# EAGLE design mainboard (EAGLE 9.4.2)

## Sheet 1 of 2
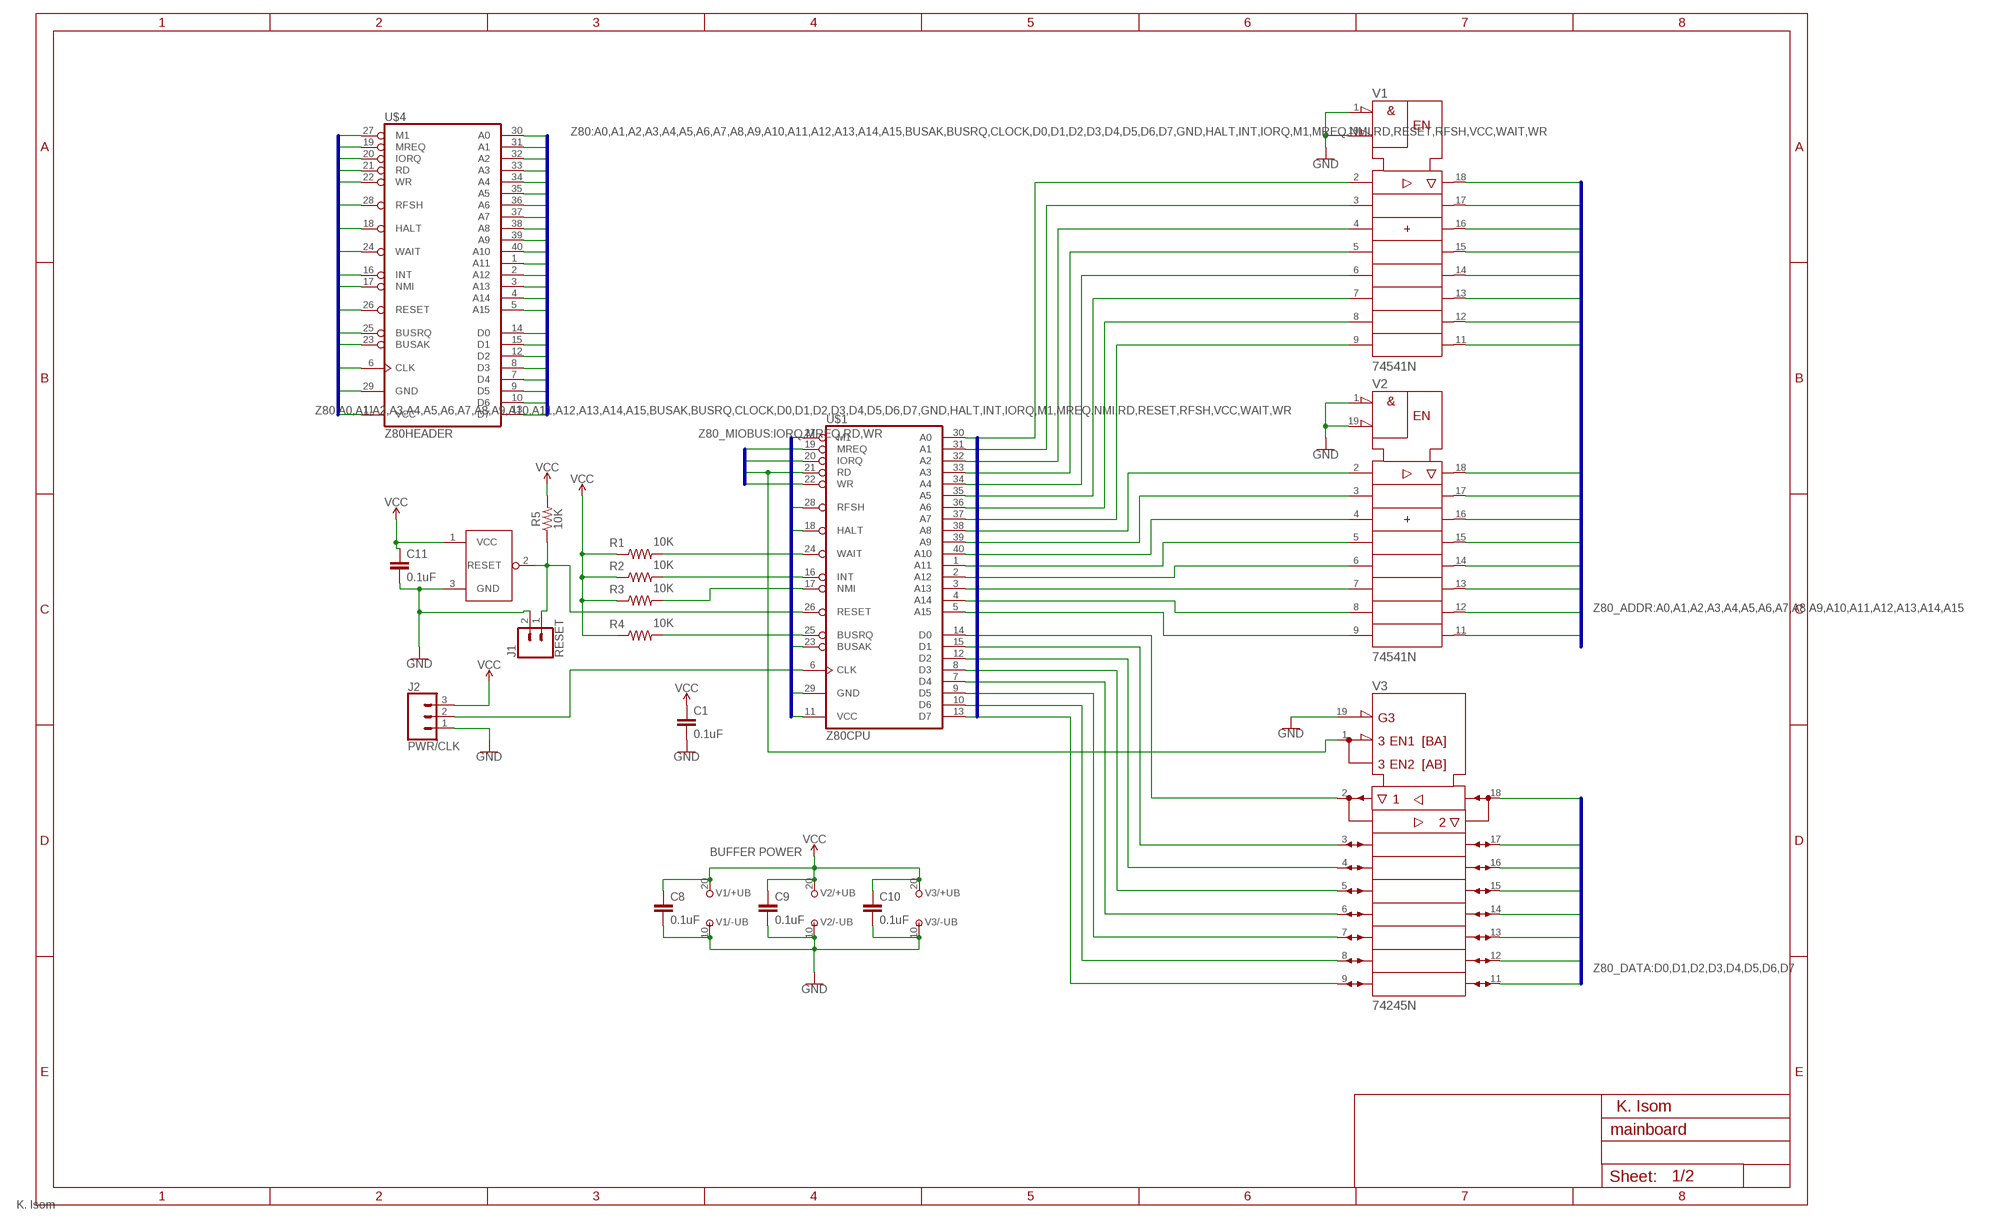
[diagram p0: schematic, sheet 1]
FRAME2 (A3L-LOC): DESIGNER: K. Isom

### Parts
C1  0.1uF  C2,5-3  [C2.5-3]
C8  0.1uF  C2,5-3  [C2.5-3]
C9  0.1uF  C2,5-3  [C2.5-3]
C10  0.1uF  C2,5-3  [C2.5-3]
C11  0.1uF  C2,5-3  [C2.5-3]
J1  RESET  CONN_02  [1X02]
J2  PWR/CLK  CONN_03-SCREW-5MM  [SCREWTERMINAL-5MM-3]
R1  10K  RESISTORAXIAL-0.3  [AXIAL-0.3]
R2  10K  RESISTORAXIAL-0.3  [AXIAL-0.3]
R3  10K  RESISTORAXIAL-0.3  [AXIAL-0.3]
R4  10K  RESISTORAXIAL-0.3  [AXIAL-0.3]
R5  10K  RESISTORAXIAL-0.3  [AXIAL-0.3]
U$1  Z80CPU  [DIL40]
U$2  MCP120/MCP130  [TO-92-AMMO]
U$4  Z80HEADER  [2X20]
V1  74541N  [DIL20]
V2  74541N  [DIL20]
V3  74245N  [DIL20]

### Nets
A0: U$1.30(A0) U$4.30(A0) V1.2(A1) V1.18(Y1) ; also sheet 2
A1: U$1.31(A1) U$4.31(A1) V1.3(A2) V1.17(Y2) ; also sheet 2
A2: U$1.32(A2) U$4.32(A2) V1.4(A3) V1.16(Y3) ; also sheet 2
A3: U$1.33(A3) U$4.33(A3) V1.5(A4) V1.15(Y4) ; also sheet 2
A4: U$1.34(A4) U$4.34(A4) V1.6(A5) V1.14(Y5) ; also sheet 2
A5: U$1.35(A5) U$4.35(A5) V1.7(A6) V1.13(Y6) ; also sheet 2
A6: U$1.36(A6) U$4.36(A6) V1.8(A7) V1.12(Y7) ; also sheet 2
A7: U$1.37(A7) U$4.37(A7) V1.9(A8) V1.11(Y8) ; also sheet 2
A8: U$1.38(A8) U$4.38(A8) V2.2(A1) V2.18(Y1) ; also sheet 2
A9: U$1.39(A9) U$4.39(A9) V2.3(A2) V2.17(Y2) ; also sheet 2
A10: U$1.40(A10) U$4.40(A10) V2.4(A3) V2.16(Y3) ; also sheet 2
A11: U$1.1(A11) U$4.1(A11) V2.5(A4) V2.15(Y4) ; also sheet 2
A12: U$1.2(A12) U$4.2(A12) V2.6(A5) V2.14(Y5) ; also sheet 2
A13: U$1.3(A13) U$4.3(A13) V2.7(A6) V2.13(Y6) ; also sheet 2
A14: U$1.4(A14) U$4.4(A14) V2.8(A7) V2.12(Y7) ; also sheet 2
A15: U$1.5(A15) U$4.5(A15) V2.9(A8) V2.11(Y8) ; also sheet 2
BUSAK: U$1.23(BUSAK) U$4.23(BUSAK)
BUSRQ: R4.P$2 U$1.25(BUSRQ) U$4.25(BUSRQ)
CLOCK: J2.2 U$1.6(CLK) U$4.6(CLK)
D0: U$1.14(D0) U$4.14(D0) V3.2(A1) V3.18(B1) ; also sheet 2
D1: U$1.15(D1) U$4.15(D1) V3.3(A2) V3.17(B2) ; also sheet 2
D2: U$1.12(D2) U$4.12(D2) V3.4(A3) V3.16(B3) ; also sheet 2
D3: U$1.8(D3) U$4.8(D3) V3.5(A4) V3.15(B4) ; also sheet 2
D4: U$1.7(D4) U$4.7(D4) V3.6(A5) V3.14(B5) ; also sheet 2
D5: U$1.9(D5) U$4.9(D5) V3.7(A6) V3.13(B6) ; also sheet 2
D6: U$1.10(D6) U$4.10(D6) V3.8(A7) V3.12(B7) ; also sheet 2
D7: U$1.13(D7) U$4.13(D7) V3.9(A8) V3.11(B8) ; also sheet 2
GND: C1.2 C8.2 C9.2 C10.2 C11.2 J1.2 J2.1 U$1.29(GND) U$2.3(GND) U$4.29(GND) V1.1(!G1) V1.10(-UB) V1.19(!G2) V2.1(!G1) V2.10(-UB) V2.19(!G2) V3.10(-UB) V3.19(!G) ; also sheet 2
HALT: U$1.18(HALT) U$4.18(HALT)
INT: R2.P$2 U$1.16(INT) U$4.16(INT)
IORQ: U$1.20(IORQ) U$4.20(IORQ)
M1: U$1.27(M1) U$4.27(M1)
MREQ: U$1.19(MREQ) U$4.19(MREQ) ; also sheet 2
NMI: R3.P$2 U$1.17(NMI) U$4.17(NMI)
RD: U$1.21(RD) U$4.21(RD) V3.1(DIR) ; also sheet 2
RESET: J1.1 R5.P$1 U$1.26(RESET) U$2.2(RESET) U$4.26(RESET)
RFSH: U$1.28(RFSH) U$4.28(RFSH)
VCC: C1.1 C8.1 C9.1 C10.1 C11.1 J2.3 R1.P$1 R2.P$1 R3.P$1 R4.P$1 R5.P$2 U$1.11(VCC) U$2.1(VCC) U$4.11(VCC) V1.20(+UB) V2.20(+UB) V3.20(+UB) ; also sheet 2
WAIT: R1.P$2 U$1.24(WAIT) U$4.24(WAIT)
WR: U$1.22(WR) U$4.22(WR) ; also sheet 2

### Buses
Z80:A0,A1,A2,A3,A4,A5,A6,A7,A8,A9,A10,A11,A12,A13,A14,A15,BUSAK,BUSRQ,CLOCK,D0,D1,D2,D3,D4,D5,D6,D7,GND,HALT,INT,IORQ,M1,MREQ,NMI,RD,RESET,RFSH,VCC,WAIT,WR
Z80_MIOBUS:IORQ,MREQ,RD,WR
Z80_ADDR:A0,A1,A2,A3,A4,A5,A6,A7,A8,A9,A10,A11,A12,A13,A14,A15
Z80_DATA:D0,D1,D2,D3,D4,D5,D6,D7

### Notes on the sheet
- BUFFER POWER
- K. Isom

## Sheet 2 of 2
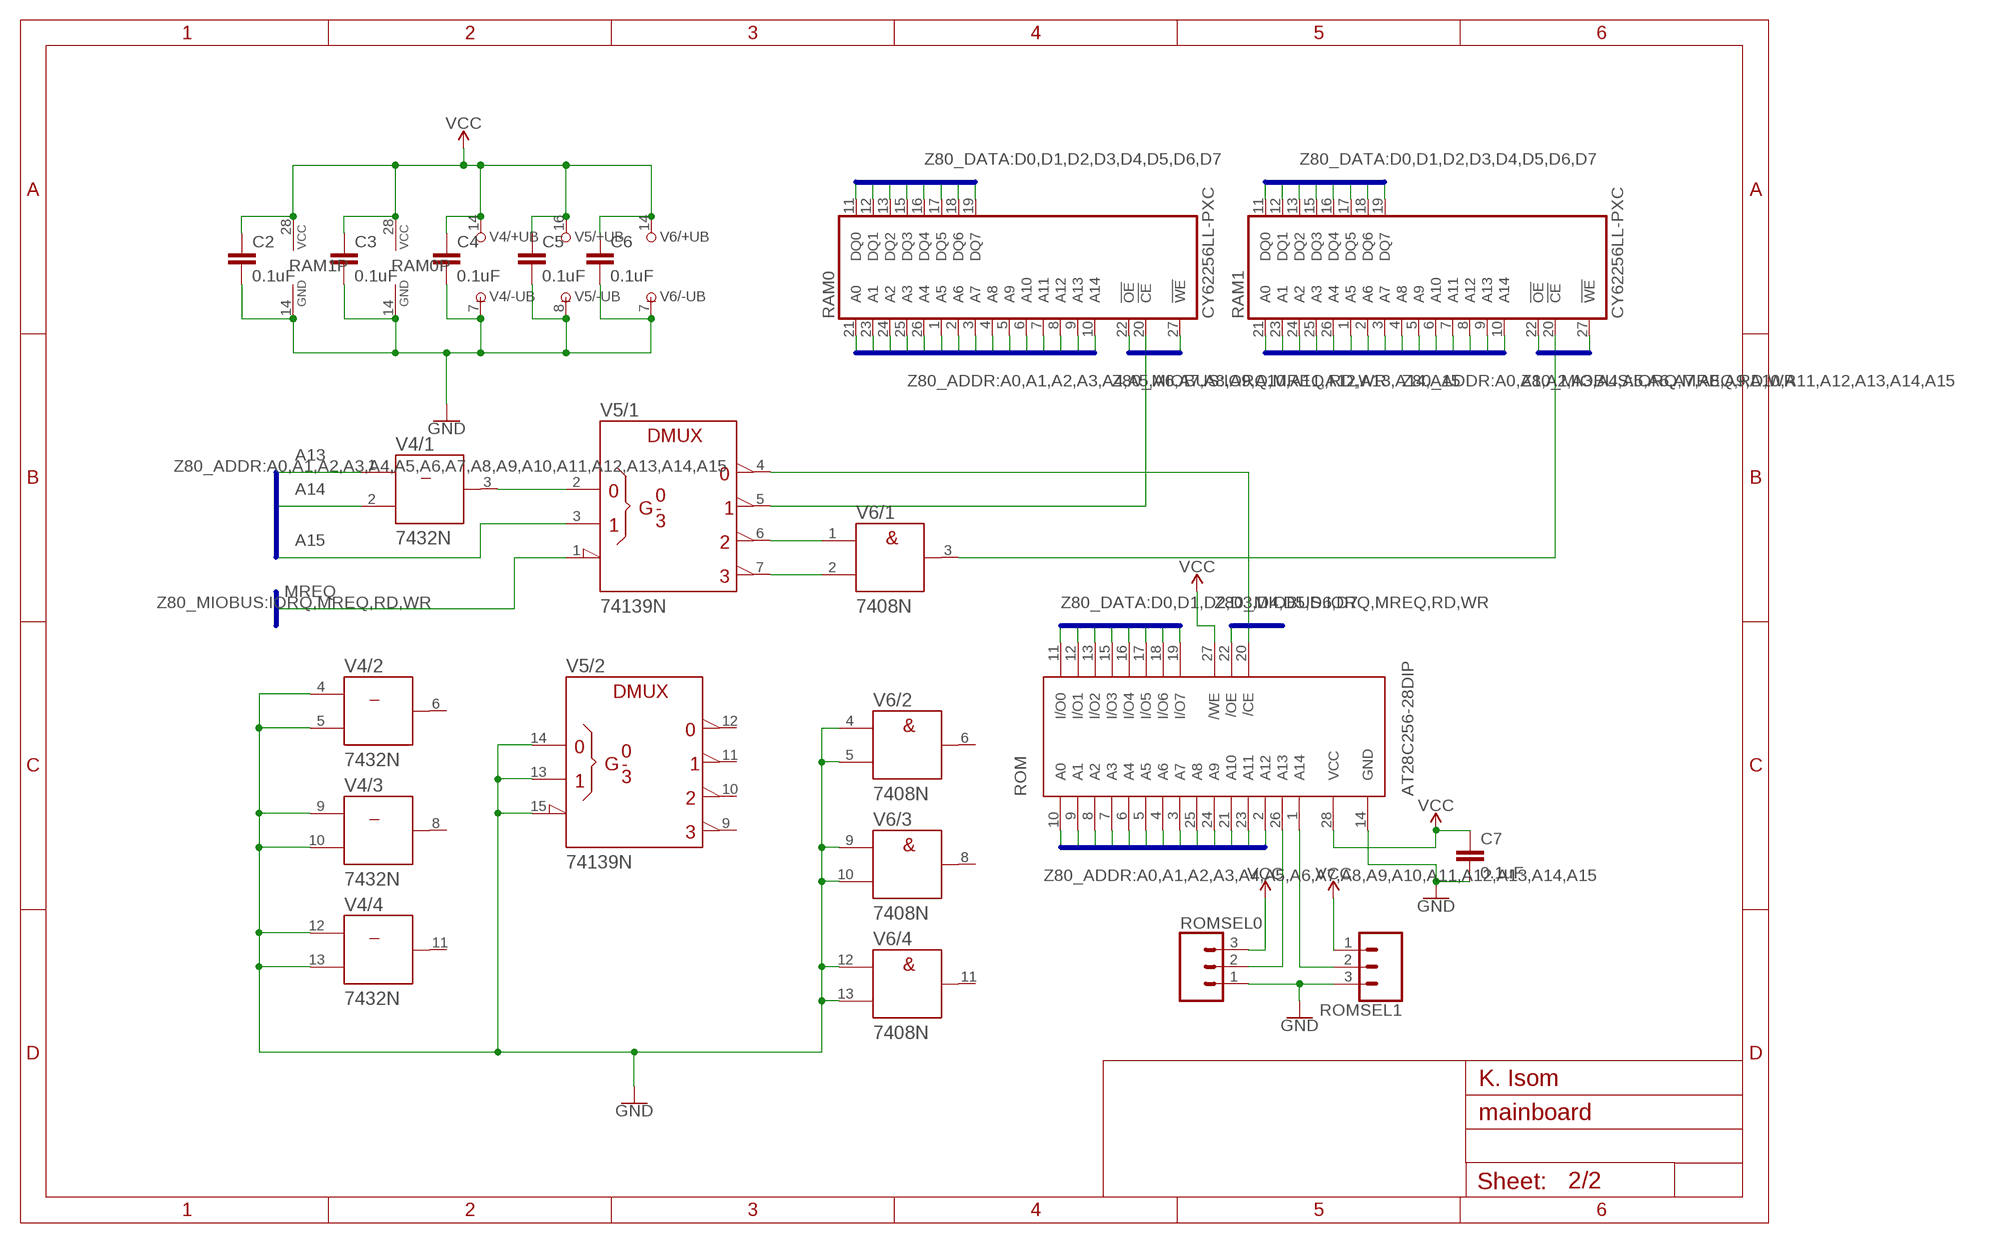
[diagram p1: schematic, sheet 2]

### Parts
C2  0.1uF  C2,5-3  [C2.5-3]
C3  0.1uF  C2,5-3  [C2.5-3]
C4  0.1uF  C2,5-3  [C2.5-3]
C5  0.1uF  C2,5-3  [C2.5-3]
C6  0.1uF  C2,5-3  [C2.5-3]
C7  0.1uF  C2,5-3  [C2.5-3]
RAM0  CY62256LL-PXC  [DIL28-6]
RAM1  CY62256LL-PXC  [DIL28-6]
ROM  AT28C256-28DIP  [DIL28-6]
ROMSEL0  455-1750-1-ND  CONN_03  [1X03]
ROMSEL1  455-1750-1-ND  CONN_03  [1X03]
V4  7432N  [DIL14]
V5  74139N  [DIL16]
V6  7408N  [DIL14]

### Nets
A0: RAM0.21(A0) RAM1.21(A0) ROM.10(A0) ; also sheet 1
A1: RAM0.23(A1) RAM1.23(A1) ROM.9(A1) ; also sheet 1
A2: RAM0.24(A2) RAM1.24(A2) ROM.8(A2) ; also sheet 1
A3: RAM0.25(A3) RAM1.25(A3) ROM.7(A3) ; also sheet 1
A4: RAM0.26(A4) RAM1.26(A4) ROM.6(A4) ; also sheet 1
A5: RAM0.1(A5) RAM1.1(A5) ROM.5(A5) ; also sheet 1
A6: RAM0.2(A6) RAM1.2(A6) ROM.4(A6) ; also sheet 1
A7: RAM0.3(A7) RAM1.3(A7) ROM.3(A7) ; also sheet 1
A8: RAM0.4(A8) RAM1.4(A8) ROM.25(A8) ; also sheet 1
A9: RAM0.5(A9) RAM1.5(A9) ROM.24(A9) ; also sheet 1
A10: RAM0.6(A10) RAM1.6(A10) ROM.21(A10) ; also sheet 1
A11: RAM0.7(A11) RAM1.7(A11) ROM.23(A11) ; also sheet 1
A12: RAM0.8(A12) RAM1.8(A12) ROM.2(A12) ; also sheet 1
A13: RAM0.9(A13) RAM1.9(A13) V4.1(/1:A) ; also sheet 1
A14: RAM0.10(A14) RAM1.10(A14) V4.2(/1:B) ; also sheet 1
A15: V5.3(/1:B) ; also sheet 1
D0: RAM0.11(DQ0) RAM1.11(DQ0) ROM.11(I/O0) ; also sheet 1
D1: RAM0.12(DQ1) RAM1.12(DQ1) ROM.12(I/O1) ; also sheet 1
D2: RAM0.13(DQ2) RAM1.13(DQ2) ROM.13(I/O2) ; also sheet 1
D3: RAM0.15(DQ3) RAM1.15(DQ3) ROM.15(I/O3) ; also sheet 1
D4: RAM0.16(DQ4) RAM1.16(DQ4) ROM.16(I/O4) ; also sheet 1
D5: RAM0.17(DQ5) RAM1.17(DQ5) ROM.17(I/O5) ; also sheet 1
D6: RAM0.18(DQ6) RAM1.18(DQ6) ROM.18(I/O6) ; also sheet 1
D7: RAM0.19(DQ7) RAM1.19(DQ7) ROM.19(I/O7) ; also sheet 1
GND: C2.2 C3.2 C4.2 C5.2 C6.2 C7.2 RAM0.14(GND) RAM1.14(GND) ROM.14(GND) ROMSEL0.1 ROMSEL1.3 V4.4(/2:A) V4.5(/2:B) V4.7(/-UB:-UB) V4.9(/3:A) V4.10(/3:B) V4.12(/4:A) V4.13(/4:B) V5.8(/-UB:-UB) V5.13(/2:B) V5.14(/2:A) V5.15(/2:!G) V6.4(/2:A) V6.5(/2:B) V6.7(/-UB:-UB) V6.9(/3:A) V6.10(/3:B) V6.12(/4:A) V6.13(/4:B) ; also sheet 1
MREQ: V5.1(/1:!G) ; also sheet 1
N$1: ROM.26(A13) ROMSEL0.2
N$2: V4.3(/1:Y) V5.2(/1:A)
N$3: V5.6(/1:Y2) V6.1(/1:A)
N$4: V5.7(/1:Y3) V6.2(/1:B)
N$5: RAM0.20(!CE) V5.5(/1:Y1)
N$6: ROM.20(/CE) V5.4(/1:Y0)
N$7: RAM1.20(!CE) V6.3(/1:Y)
N$9: ROM.1(A14) ROMSEL1.2
RD: RAM0.22(!OE) RAM1.22(!OE) ROM.22(/OE) ; also sheet 1
VCC: C2.1 C3.1 C4.1 C5.1 C6.1 C7.1 RAM0.28(VCC) RAM1.28(VCC) ROM.27(/WE) ROM.28(VCC) ROMSEL0.3 ROMSEL1.1 V4.14(/+UB:+UB) V5.16(/+UB:+UB) V6.14(/+UB:+UB) ; also sheet 1
WR: RAM0.27(!WE) RAM1.27(!WE) ; also sheet 1
Unconnected: V4.6(/2:Y) V4.8(/3:Y) V4.11(/4:Y) V5.9(/2:Y3) V5.10(/2:Y2) V5.11(/2:Y1) V5.12(/2:Y0) V6.6(/2:Y) V6.8(/3:Y) V6.11(/4:Y)

### Buses
Z80_ADDR:A0,A1,A2,A3,A4,A5,A6,A7,A8,A9,A10,A11,A12,A13,A14,A15
Z80_MIOBUS:IORQ,MREQ,RD,WR
Z80_DATA:D0,D1,D2,D3,D4,D5,D6,D7

### Notes on the sheet
- A13
- A14
- A15
- MREQ
- K. Isom

## Library data of the parts
C1-C11 = capacitor-wima:C: CAPACITOR naming: grid - package width
J1 = SparkFun-Connectors:CONN_02: Multi connection point. Often used as Generic Header-pin footprint for 0.1 inch spaced/style header connections On any of the 0.1 inch spaced packages, you can populate with these: Break Away Headers - Straight <https://www.sparkfun.com/products/116> (PRT-00116) Break Away Male Headers - Right Angle <https://www.sparkfun.com/products/553> (PRT-00553) Female Headers <https://www.sparkfun.com/products/115> (PRT-00115) Break Away Headers - Machine Pin <https://www.sparkfun.com/products/117> (PRT-00117) Break Away Female Headers - Swiss Machine Pin <https://www.sparkfun.com/products/743> (PRT-00743) For SCREWTERMINALS and SPRING TERMINALS visit here: Screw Terimnals on SparkFun.com <https://www.sparkfun.com/search/results?term=Screw+Terminals> (5mm/3.5mm/2.54mm spacing) This device is also useful as a general connection point to wire up your design to another part of your project. Our various solder wires solder well into these plated through hole pads. Hook-Up Wire - Assortment (Stranded, 22 AWG) <https://www.sparkfun.com/products/11375> (PRT-11375) Hook-Up Wire - Assortment (Solid Core, 22 AWG) <https://www.sparkfun.com/products/11367> (PRT-11367) View the entire wire category on our website here <https://www.sparkfun.com/categories/141> Special notes: Molex polarized connector foot print use with: PRT-08233 with associated crimp pins and housings. 2.54_SCREWTERM for use with PRT-10571. 3.5mm Screw Terminal footprints for PRT-08084 5mm Screw Terminal footprints for use with PRT-08432
J2 = SparkFun-Connectors:CONN_03: Multi connection point. Often used as Generic Header-pin footprint for 0.1 inch spaced/style header connections On any of the 0.1 inch spaced packages, you can populate with these: Break Away Headers - Straight <https://www.sparkfun.com/products/116> (PRT-00116) Break Away Male Headers - Right Angle <https://www.sparkfun.com/products/553> (PRT-00553) Female Headers <https://www.sparkfun.com/products/115> (PRT-00115) Break Away Headers - Machine Pin <https://www.sparkfun.com/products/117> (PRT-00117) Break Away Female Headers - Swiss Machine Pin <https://www.sparkfun.com/products/743> (PRT-00743) Stackable Header - 3 Pin (Female, 0.1") <https://www.sparkfun.com/products/13875> (PRT-13875) For SCREWTERMINALS and SPRING TERMINALS visit here: Screw Terimnals on SparkFun.com <https://www.sparkfun.com/search/results?term=Screw+Terminals> (5mm/3.5mm/2.54mm spacing) This device is also useful as a general connection point to wire up your design to another part of your project. Our various solder wires solder well into these plated through hole pads. Hook-Up Wire - Assortment (Stranded, 22 AWG) <https://www.sparkfun.com/products/11375> (PRT-11375) Hook-Up Wire - Assortment (Solid Core, 22 AWG) <https://www.sparkfun.com/products/11367> (PRT-11367) View the entire wire category on our website here <https://www.sparkfun.com/categories/141> Special notes: Molex polarized connector foot print use with SKU : PRT-08232 with associated crimp pins and housings.; PROD_ID: CONN-10134; SF_SKU: PRT-08433
R1-R5 = SparkFun-Resistors:RESISTOR: Generic Resistor Package
RAM0 RAM1 = memory-sram:CY62256LL-?*: 256K (32K x 8) CMOS-Static RAM Source: http://download.cypress.com.edgesuite.net/design_resources/datasheets/contents/cy62256_8.pdf
ROM = atmel-custom:AT28C256-28DIP: IC EEPROM 256KBIT 150NS 28DIP
ROMSEL0 ROMSEL1 = SparkFun-Connectors:CONN_03: Multi connection point. Often used as Generic Header-pin footprint for 0.1 inch spaced/style header connections On any of the 0.1 inch spaced packages, you can populate with these: Break Away Headers - Straight <https://www.sparkfun.com/products/116> (PRT-00116) Break Away Male Headers - Right Angle <https://www.sparkfun.com/products/553> (PRT-00553) Female Headers <https://www.sparkfun.com/products/115> (PRT-00115) Break Away Headers - Machine Pin <https://www.sparkfun.com/products/117> (PRT-00117) Break Away Female Headers - Swiss Machine Pin <https://www.sparkfun.com/products/743> (PRT-00743) Stackable Header - 3 Pin (Female, 0.1") <https://www.sparkfun.com/products/13875> (PRT-13875) For SCREWTERMINALS and SPRING TERMINALS visit here: Screw Terimnals on SparkFun.com <https://www.sparkfun.com/search/results?term=Screw+Terminals> (5mm/3.5mm/2.54mm spacing) This device is also useful as a general connection point to wire up your design to another part of your project. Our various solder wires solder well into these plated through hole pads. Hook-Up Wire - Assortment (Stranded, 22 AWG) <https://www.sparkfun.com/products/11375> (PRT-11375) Hook-Up Wire - Assortment (Solid Core, 22 AWG) <https://www.sparkfun.com/products/11367> (PRT-11367) View the entire wire category on our website here <https://www.sparkfun.com/categories/141> Special notes: Molex polarized connector foot print use with SKU : PRT-08232 with associated crimp pins and housings.; PROD_ID: XXX-00000
U$1 U$4 = wntrmute:Z80
U$2 = wntrmute:MCP120/MCP130: Microcontroller Supervisory Circuit with Open Drain Output. Digikey part MCP120-485HI/TO-ND <https://www.digikey.com/product-detail/en/MCP120-485HI%2fTO/MCP120-485HI%2fTO-ND/319366/?itemSeq=301799207>.
V1 V2 = 74ttl-din:74*541: Octal BUFFER and LINE DRIVER, 3-state
V3 = 74ttl-din:74*245: Octal BUS TRANSCEIVER, 3-state
V4 = 74ttl-din:74*32: Quad 2-input OR gate
V5 = 74ttl-din:74*139: Dual 2-line to 4-line DECODER/DEMULTIPLEXER
V6 = 74ttl-din:74*08: Quad 2-input AND gate

## Net classes
0 default: width 0.152 mm, drill 0.254 mm, clearance 0.152 mm

## Board
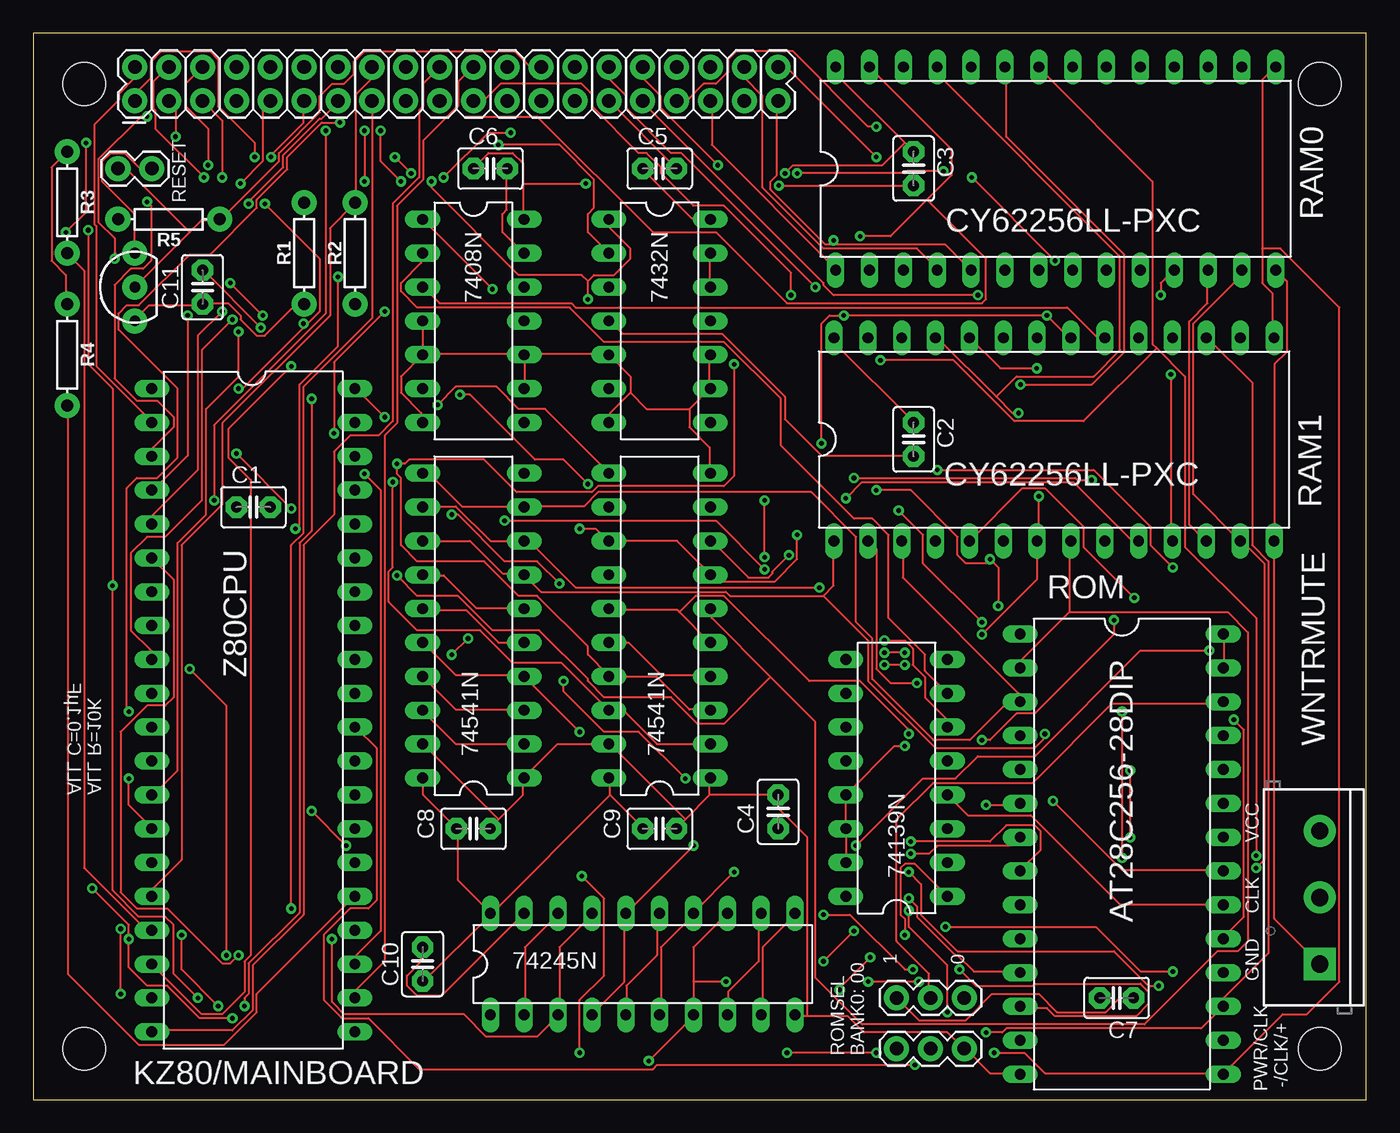
[diagram p2: board, top side]
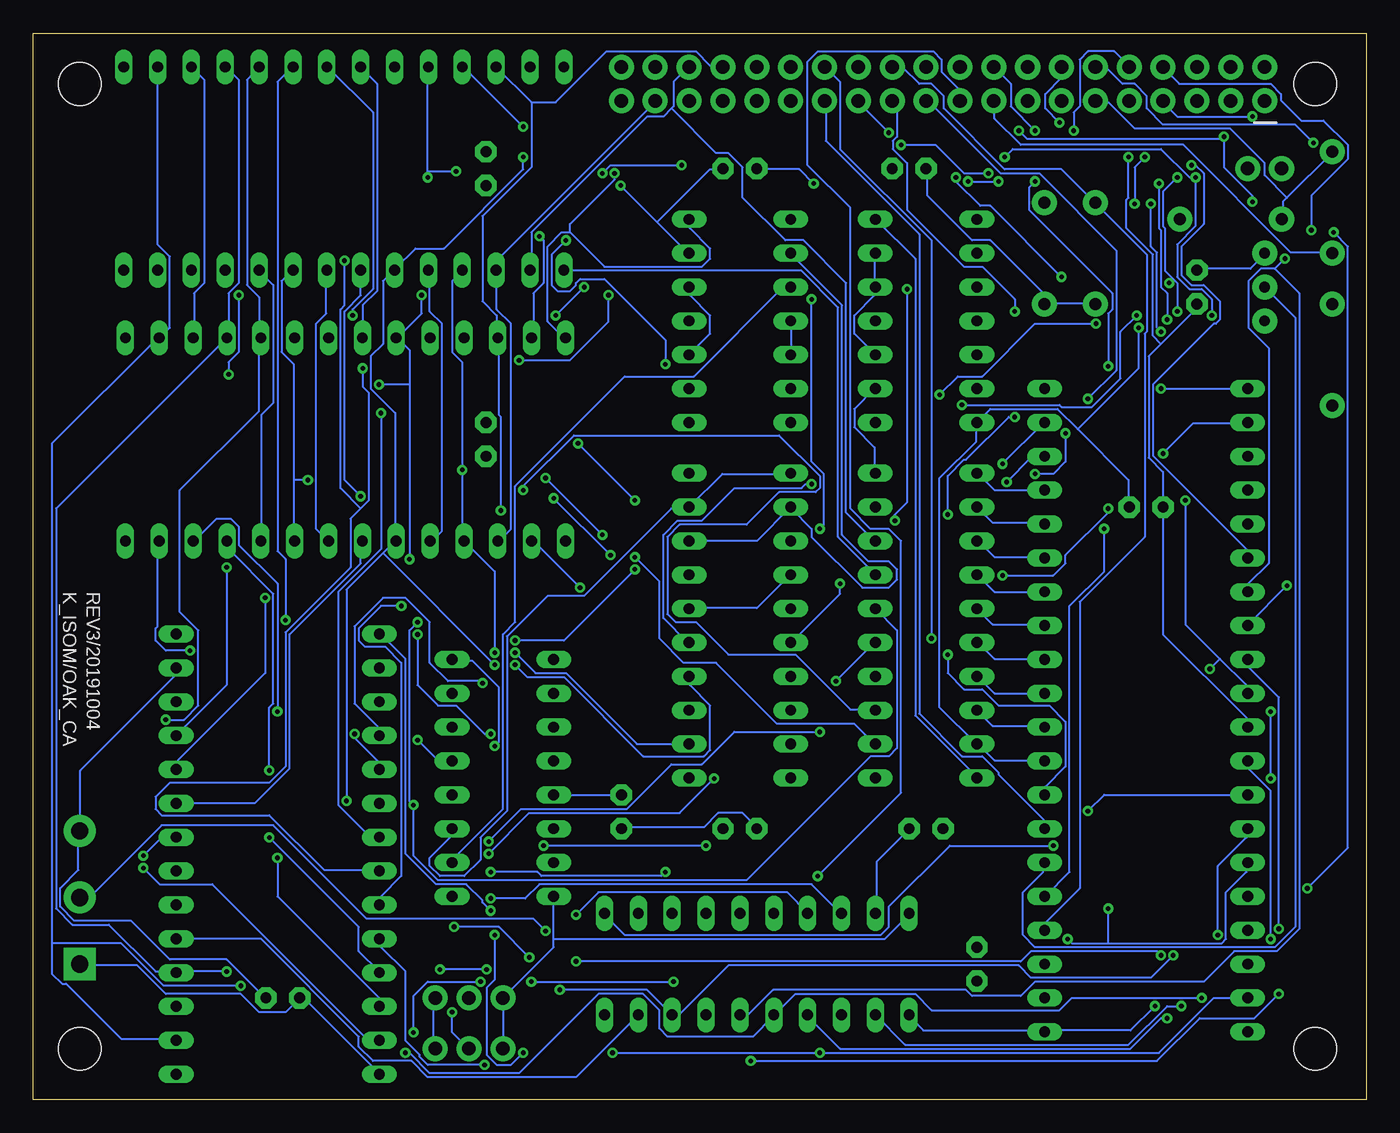
[diagram p3: board, bottom side, seen from below]

Size 100 x 80 mm. Coordinates in mm from the lower left corner, seen from the top.
Outline: 0,0 100,0 100,80 0,80 0,0
Copper layers (1*16): Top 0.035mm / dielectric 1.5mm / Bottom 0.035mm
Design rules "default": minimum track width 6mil, minimum drill 0.35mm, track to track 6mil, track to pad 6mil, pad to pad 6mil, via to via 6mil, smd to smd 6mil, copper to edge 40mil, drill to drill 6mil, minimum pad ring 10mil, minimum via ring 8mil, stop-mask expansion 4mil, vias tented up to drill 0mil, thermal gap 10mil
Holes 3.2 mm at 3.81,76.2 3.81,3.81 96.52,3.81 96.52,76.2

### Footprints (pad centres in the part's own frame; a part is rotated, then mirrored left to right if it is on the bottom)
C2.5-3 = drill 0.813 pad 1.6 octagon: 1 -1.27,0; 2 1.27,0
1X02 = drill 1.016 pad 1.88: 1 0,0; 2 2.54,0
SCREWTERMINAL-5MM-3 = drill 1.3 pad 2.413 square: 1 0,0 | drill 1.3 pad 2.413: 2 5,0; 3 10,0
AXIAL-0.3 = drill 0.9 pad 1.88: P$1 -3.81,0; P$2 3.81,0
DIL28-6 = drill 0.813 long: 1 -16.51,-7.62; 2 -13.97,-7.62; 3 -11.43,-7.62; 4 -8.89,-7.62; 5 -6.35,-7.62; 6 -3.81,-7.62; 7 -1.27,-7.62; 8 1.27,-7.62; 9 3.81,-7.62; 10 6.35,-7.62; 11 8.89,-7.62; 12 11.43,-7.62; 13 13.97,-7.62; 14 16.51,-7.62; 15 16.51,7.62; 16 13.97,7.62; 17 11.43,7.62; 18 8.89,7.62; 19 6.35,7.62; 20 3.81,7.62; 21 1.27,7.62; 22 -1.27,7.62; 23 -3.81,7.62; 24 -6.35,7.62; 25 -8.89,7.62; 26 -11.43,7.62; 27 -13.97,7.62; 28 -16.51,7.62
1X03 = drill 1.016 pad 1.88: 1 0,0; 2 2.54,0; 3 5.08,0
DIL40 = drill 0.813 long: 1 -24.13,-7.62; 2 -21.59,-7.62; 3 -19.05,-7.62; 4 -16.51,-7.62; 5 -13.97,-7.62; 6 -11.43,-7.62; 7 -8.89,-7.62; 8 -6.35,-7.62; 9 -3.81,-7.62; 10 -1.27,-7.62; 11 1.27,-7.62; 12 3.81,-7.62; 13 6.35,-7.62; 14 8.89,-7.62; 15 11.43,-7.62; 16 13.97,-7.62; 17 16.51,-7.62; 18 19.05,-7.62; 19 21.59,-7.62; 20 24.13,-7.62; 21 24.13,7.62; 22 21.59,7.62; 23 19.05,7.62; 24 16.51,7.62; 25 13.97,7.62; 26 11.43,7.62; 27 8.89,7.62; 28 6.35,7.62; 29 3.81,7.62; 30 1.27,7.62; 31 -1.27,7.62; 32 -3.81,7.62; 33 -6.35,7.62; 34 -8.89,7.62; 35 -11.43,7.62; 36 -13.97,7.62; 37 -16.51,7.62; 38 -19.05,7.62; 39 -21.59,7.62; 40 -24.13,7.62
TO-92-AMMO = drill 0.813 pad 1.88: 1 -2.54,0; 2 0,0; 3 2.54,0
2X20 = drill 1.016 pad 1.88: 1 0,0; 2 0,2.54; 3 2.54,0; 4 2.54,2.54; 5 5.08,0; 6 5.08,2.54; 7 7.62,0; 8 7.62,2.54; 9 10.16,0; 10 10.16,2.54; 11 12.7,0; 12 12.7,2.54; 13 15.24,0; 14 15.24,2.54; 15 17.78,0; 16 17.78,2.54; 17 20.32,0; 18 20.32,2.54; 19 22.86,0; 20 22.86,2.54; 21 25.4,0; 22 25.4,2.54; 23 27.94,0; 24 27.94,2.54; 25 30.48,0; 26 30.48,2.54; 27 33.02,0; 28 33.02,2.54; 29 35.56,0; 30 35.56,2.54; 31 38.1,0; 32 38.1,2.54; 33 40.64,0; 34 40.64,2.54; 35 43.18,0; 36 43.18,2.54; 37 45.72,0; 38 45.72,2.54; 39 48.26,0; 40 48.26,2.54
DIL20 = drill 0.813 long: 1 -11.43,-3.81; 2 -8.89,-3.81; 3 -6.35,-3.81; 4 -3.81,-3.81; 5 -1.27,-3.81; 6 1.27,-3.81; 7 3.81,-3.81; 8 6.35,-3.81; 9 8.89,-3.81; 10 11.43,-3.81; 11 11.43,3.81; 12 8.89,3.81; 13 6.35,3.81; 14 3.81,3.81; 15 1.27,3.81; 16 -1.27,3.81; 17 -3.81,3.81; 18 -6.35,3.81; 19 -8.89,3.81; 20 -11.43,3.81
DIL14 = drill 0.813 long: 1 -7.62,-3.81; 2 -5.08,-3.81; 3 -2.54,-3.81; 4 0,-3.81; 5 2.54,-3.81; 6 5.08,-3.81; 7 7.62,-3.81; 8 7.62,3.81; 9 5.08,3.81; 10 2.54,3.81; 11 0,3.81; 12 -2.54,3.81; 13 -5.08,3.81; 14 -7.62,3.81
DIL16 = drill 0.813 long: 1 -8.89,-3.81; 2 -6.35,-3.81; 3 -3.81,-3.81; 4 -1.27,-3.81; 5 1.27,-3.81; 6 3.81,-3.81; 7 6.35,-3.81; 8 8.89,-3.81; 9 8.89,3.81; 10 6.35,3.81; 11 3.81,3.81; 12 1.27,3.81; 13 -1.27,3.81; 14 -3.81,3.81; 15 -6.35,3.81; 16 -8.89,3.81

### Placement (x,y rotation side)
C1  16.51,44.45 0 top
C2  66.04,49.53 270 top
C3  66.04,69.85 270 top
C4  55.88,21.59 90 top
C5  46.99,69.85 0 top
C6  34.29,69.85 0 top
C7  81.28,7.62 180 top
C8  33.02,20.32 0 top
C9  46.99,20.32 0 top
C10  29.21,10.16 90 top
C11  12.7,60.96 90 top
J1  6.35,69.85 0 top
J2  96.52,10.16 90 top
R1  20.32,63.5 90 top
R2  24.13,63.5 90 top
R3  2.54,67.31 270 top
R4  2.54,55.88 270 top
R5  10.16,66.04 180 top
RAM0  76.71,69.85 0 top
RAM1  76.58,49.53 0 top
ROM  81.66,18.41 270 top
ROMSEL0  69.85,7.62 180 top
ROMSEL1  64.77,3.81 0 top
U$1  16.51,29.21 270 top
U$2  7.62,60.96 90 top
U$4  7.62,74.93 0 top
V1  33.02,35.56 90 top
V2  46.99,35.56 90 top
V3  45.72,10.16 0 top
V4  46.99,58.42 270 top
V5  64.77,24.13 90 top
V6  33.02,58.42 270 top

### Tracks (layer width: path | path; a pad name or v marks a point on that pad's centre or on a via)
A0  (via drill 0.35)
  Top 0.152: RAM1.21 77.72,57.15 v76.05,58.83 v60.81,58.83 59.74,58.83 59.13,58.22 v59.13,49.23 | v58.67,60.96 48.62,71.02 47.85,71.02 44.5,74.37 44.5,75.29 43.28,76.5 43.28,77.42 U$4.30 | V1.2 31.7,26.67 29.26,29.11 V1.18 | v66.14,2.59 46.79,2.59 46.48,2.29 28.96,2.29 25.15,6.1 23.16,6.1 21.79,7.47 21.79,12.34 23.77,14.33 25.15,14.33 25.76,14.94 25.76,26.36 24.23,27.89 U$1.30 | v54.86,40.69 v54.86,44.96
  Bottom 0.152: v76.05,58.83 76.05,59.28 74.52,60.81 74.52,74.07 77.88,77.42 RAM0.21 | v60.81,58.83 v58.67,60.96 | V1.18 28.04,28.04 24.23,28.04 U$1.30 | v66.14,2.59 70.41,2.59 71.02,3.2 71.02,3.35 72.08,4.42 72.08,9.6 73.91,11.43 73.91,12.04 ROM.10 | v54.86,44.96 v59.13,49.23 | v54.86,40.69 53.03,38.86 53.03,34.59 51.21,32.77 48.77,32.77 44.2,28.19 38.41,28.19 36.88,26.67 V1.2
A1  (via drill 0.35)
  Top 0.152: V1.17 31.7,29.26 36.73,29.26 V1.3 | v72.39,37.03 72.39,39.93 v71.78,40.54 71.48,40.23 69.95,40.23 69.34,40.84 69.34,42.22 65.84,45.72 v63.25,45.72 | v74.07,53.65 79.4,53.65 81.84,56.08 81.84,63.4 73,72.24 73,77.42 RAM0.23 | v70.87,60.35 60.05,60.35 59.28,61.11 59.28,61.27 45.72,74.83 U$4.31
  Bottom 0.152: U$1.31 27.89,30.48 29.11,31.7 V1.17 | v72.39,37.03 73.91,37.03 75.59,35.36 75.59,34.44 75.13,33.98 73.61,33.98 72.39,32.77 72.39,16.76 73.91,15.24 73.91,14.63 ROM.9 | 71.78,53.65 71.78,56.24 72.69,57.15 | 71.78,53.65 v71.78,40.54 | 71.78,53.65 v74.07,53.65 | v70.87,60.35 70.87,58.98 72.69,57.15 | 72.69,57.15 RAM1.23 | v63.25,45.72 63.25,46.02 59.44,49.84 44.04,49.84 41,46.79 41,45.87 41.3,45.57 44.04,45.57 46.48,43.13 51.51,43.13 52.43,42.22 52.43,36.42 51.82,35.81 50.29,35.81 47.85,33.38 42.82,33.38 38.71,29.26 36.88,29.26 V1.3
A2  (via drill 0.35)
  Top 0.152: V1.16 29.26,34.29 31.7,31.85 36.73,31.85 V1.4 v41,27.58 | v75.29,54.86 72.54,54.86 70.26,57.15 RAM1.24 | v76.66,62.94 v70.41,69.19 | U$4.32 45.72,76.66 47.09,75.29 47.09,74.37 v51.36,70.1 | v57.3,69.49 65.38,69.49 65.53,69.65 v68.28,69.65 | v65.84,19.36 71.78,19.36 73,20.57 75.13,20.57 75.59,20.12 75.59,18.75 74.07,17.22 ROM.8
  Bottom 0.152: U$1.32 24.23,33.07 27.89,33.07 29.11,34.29 V1.16 | 75.44,44.35 74.83,44.96 74.83,53.03 75.29,53.49 v75.29,54.86 | 75.44,44.35 76.2,43.59 76.2,39.93 81.08,35.05 81.08,24.99 82.3,23.77 89.76,23.77 90.83,22.71 90.83,21.79 90.37,21.34 82.3,21.34 78.18,17.22 74.07,17.22 ROM.8 | v70.41,69.19 70.41,69.65 | 70.41,69.65 70.41,77.42 RAM0.24 | v76.66,62.94 76.66,59.59 76.96,59.28 76.96,45.87 75.44,44.35 | v51.36,70.1 56.69,70.1 v57.3,69.49 | 70.41,69.65 v68.28,69.65 | v41,27.58 47.4,27.58 49.84,25.15 52.12,25.15 55.47,21.79 63.4,21.79 v65.84,19.36
A3  (via drill 0.35)
  Top 0.152: V1.5 34.9,34.29 32.46,36.73 29.26,36.73 V1.15 | v73.91,51.51 73.46,51.51 72.24,52.73 | 72.24,52.73 67.82,57.15 RAM1.25 | RAM0.25 67.82,76.96 81.53,63.25 81.53,56.24 79.55,54.25 73.76,54.25 72.24,52.73 | v63.25,73 62.64,73 57,78.64 52.73,78.64 52.12,78.03 52.12,77.11 51.21,76.2 50.29,76.2 49.07,74.98 48.31,74.98 U$4.33 | v39.78,31.39 39.78,30.63 42.82,27.58 45.41,27.58 v48.92,24.08 | v65.84,18.44 67.21,18.44 67.82,19.05 73.3,19.05 73.91,19.66 ROM.7
  Bottom 0.152: V1.15 28.04,35.66 24.23,35.66 U$1.33 | v73.91,51.51 73.91,41.3 77.11,38.1 77.11,22.1 74.83,19.81 74.07,19.81 ROM.7 | v63.25,73 67.82,77.57 RAM0.25 | v39.78,31.39 36.88,34.29 V1.5 | v48.92,24.08 51.51,21.49 62.79,21.49 v65.84,18.44
A4  (via drill 0.35)
  Top 0.152: V1.6 36.73,36.88 33.22,36.88 30.79,39.32 29.26,39.32 V1.14 | v71.48,22.1 73.91,22.1 ROM.6 | v64.92,44.2 66.75,42.37 66.75,40.23 v71.17,35.81
  Bottom 0.152: 62.64,74.83 62.64,69.95 66.29,66.29 66.29,59.89 65.23,58.83 65.23,57.15 RAM1.26 65.08,57.15 65.08,51.36 64.92,51.21 v64.92,44.2 | RAM0.26 62.64,74.83 | 62.64,74.83 60.81,74.83 57,78.64 50.29,78.64 49.23,77.57 48.31,77.57 U$4.34 | U$1.34 27.89,38.1 29.11,39.32 V1.14 | V1.6 35.2,35.2 35.2,26.36 35.81,25.76 37.19,25.76 46.48,16.46 69.65,16.46 71.48,18.29 v71.48,22.1 71.78,22.4 71.78,35.2 v71.17,35.81
A5  (via drill 0.35)
  Top 0.152: RAM0.1 60.2,62.33 50.9,71.63 50.9,74.83 U$4.35 | V1.13 32.77,41.91 35.2,39.47 36.73,39.47 V1.7 38.1,38.1 51.97,38.1 52.27,37.8 59.28,37.8 | 59.28,37.8 60.05,38.56 60.05,41.91 RAM1.1 | v75.89,27.43 75.89,27.13 75.13,26.36 67.67,26.36 62.64,31.39 62.64,34.44 59.28,37.8
  Bottom 0.152: U$1.35 24.23,40.69 27.89,40.69 29.11,41.91 V1.13 | v75.89,27.43 75.89,27.13 74.07,25.3 74.07,24.84 ROM.5 | RAM0.1 60.2,62.18 42.37,62.18 39.62,59.44 39.62,42.22 36.88,39.47 V1.7
A6  (via drill 0.35)
  Top 0.152: V1.12 29.26,44.5 31.7,44.5 34.29,41.91 V1.8 37.19,41.91 40.69,38.41 v58.98,38.41 | v66.29,31.24 64.31,31.24 63.25,32.31 63.25,41.3 62.64,41.91 RAM1.2
  Bottom 0.152: 52.12,74.37 51.97,74.52 51.97,76.35 50.9,77.42 U$4.36 | 52.12,74.37 52.73,73.76 53.95,73.76 62.64,65.08 62.64,62.33 RAM0.2 | V1.12 28.04,43.28 24.23,43.28 U$1.36 | v58.98,38.41 62.48,41.91 RAM1.2 | v66.29,31.24 66.45,31.39 68.89,31.39 70.26,32.77 70.26,35.81 72.08,37.64 73.76,37.64 75.89,35.51 75.89,29.72 74.07,27.89 74.07,27.43 ROM.4 | 52.12,74.37 48.77,71.02 47.85,71.02 46.79,69.95 46.79,67.67 43.59,64.47 42.22,64.47 39.01,61.27 39.01,44.04 36.88,41.91 V1.8
A7
  Top 0.152: V1.11 29.26,46.94 29.72,46.94 32.16,44.5 36.73,44.5 V1.9 36.88,44.5 41.3,44.5 42.37,45.57 58.37,45.57 61.72,42.22 61.72,35.81 62.94,34.59 62.94,31.55 67.51,26.98 70.26,26.98 73,29.72 73.91,29.72 ROM.3 73.91,29.87 73.91,30.48 65.23,39.17 65.23,41.91 RAM1.3
  Bottom 0.152: U$4.37 53.34,74.83 65.23,62.94 65.23,62.33 RAM0.3 65.23,62.18 65.23,59.28 64.16,58.22 64.16,42.82 65.08,41.91 RAM1.3 | U$1.37 27.89,45.72 29.11,46.94 V1.11
A8  (via drill 0.35)
  Top 0.152: V2.2 46.79,26.67 44.35,29.11 43.28,29.11 V2.18 39.62,32.77 35.97,32.77 33.53,35.2 28.8,35.2 26.67,37.34 26.67,39.62 26.98,39.93 v26.98,46.33 | v85.5,39.93 83.82,41.6 83.82,42.98 79.55,47.24 v67.82,47.24 | U$4.38 53.34,76.66 54.71,75.29 54.71,68.43 59.28,63.86 66.29,63.86 67.82,62.33 RAM0.4 | v65.38,33.53 v63.86,33.53
  Bottom 0.152: v26.98,46.33 25.15,48.16 24.23,48.16 U$1.38 | RAM0.4 67.82,62.18 68.58,61.42 68.58,56.08 67.82,55.32 v67.82,47.24 67.82,41.91 RAM1.4 67.67,41.91 65.38,39.62 v65.38,33.53 | ROM.25 85.5,31.09 v85.5,39.93 | V2.2 54.71,26.67 60.05,32 62.33,32 v63.86,33.53
A9  (via drill 0.35)
  Top 0.152: V2.3 50.75,29.26 49.23,29.26 46.79,31.7 43.28,31.7 V2.17 43.13,31.85 41.6,33.38 41.6,33.98 37.8,37.8 36.42,37.8 33.83,40.39 28.8,40.39 27.58,41.6 27.58,46.63 27.28,46.94 v27.28,47.7 27.89,47.7 28.19,48.01 33.83,48.01 36.27,45.57 41.91,45.57 42.37,46.02 51.82,46.02 52.58,46.79 v52.58,55.17 | v82.6,37.64 78.79,41.45 78.79,42.98 75.89,45.87 74.22,45.87 70.26,41.91 RAM1.5 | 60.05,64.16 68.43,64.16 RAM0.5 | 60.05,64.16 59.44,64.16 55.32,68.28 55.32,68.89 55.78,69.34 55.78,74.83 U$4.39 | 60.05,64.16 v60.05,64.47
  Bottom 0.152: v27.28,47.7 24.23,50.75 U$1.39 | v82.6,37.64 82.6,32 89.15,25.45 89.15,24.84 ROM.24 | RAM0.5 70.26,62.18 70.26,59.13 69.34,58.22 69.34,42.67 70.1,41.91 RAM1.5 | v52.58,55.17 52.58,57 57.15,61.57 58.98,61.57 59.28,61.27 59.28,61.11 59.74,60.66 60.66,60.66 61.11,61.11 61.11,63.4 v60.05,64.47
A10  (via drill 0.35)
  Top 0.152: V2.16 44.65,34.29 47.09,31.85 50.75,31.85 V2.4 | v26.36,51.21 24.23,53.34 U$1.40 | v31.39,43.89 31.85,43.89 35.36,40.39 37.8,40.39 v39.47,38.71 | v76.5,22.4 81.69,17.22 89.15,17.22 ROM.21 | v63.25,70.71 56.54,77.42 55.93,77.42 U$4.40 | v65.38,32.61 v63.86,32.61
  Bottom 0.152: v26.36,51.21 26.82,51.21 30.02,48.01 30.18,48.01 31.39,46.79 v31.39,43.89 | v39.47,38.71 39.47,37.95 43.13,34.29 V2.16 | 72.85,41.91 72.85,51.51 74.68,53.34 74.68,55.78 73.76,56.69 73.76,61.42 73,62.18 RAM0.6 72.85,62.33 71.32,63.86 69.19,63.86 63.25,69.8 v63.25,70.71 | v76.5,22.4 76.5,38.25 73.76,41 | 72.85,41.91 73.76,41 | 72.85,41.91 RAM1.6 | v63.86,32.61 62.94,31.7 60.2,31.7 54.25,25.76 49.68,25.76 49.23,26.21 49.23,29.57 50.75,31.09 50.75,31.7 V2.4 | 73.76,41 v65.38,32.61
A11  (via drill 0.35)
  Top 0.152: v15.39,53.34 15.7,53.34 20.42,58.06 | 20.42,58.06 21.49,59.13 21.49,63.09 v17.37,67.21 | v16.61,70.71 16.61,71.78 13.87,74.52 13.87,78.03 13.26,78.64 9.6,78.64 8.84,77.88 8.84,76.66 7.62,75.44 U$4.1 | 48.46,36.58 50.75,34.29 V2.5 | 48.46,36.58 48.31,36.73 43.28,36.73 V2.15 | v75.44,45.26 75.44,41.91 RAM1.7 75.29,41.91 75.29,39.01 v71.17,34.9 | 48.46,36.58 49.68,37.8 51.82,37.8 58.22,31.39 62.03,31.39 65.68,27.74 v65.68,27.43 | v20.27,58.22 20.42,58.06 | v32,52.88 32.77,52.88 37.64,48.01 39.78,48.01 v41.6,46.18
  Bottom 0.152: v15.39,53.34 U$1.1 | v17.37,67.21 17.37,69.95 v16.61,70.71 | RAM1.7 75.44,41.91 75.44,40.23 80.77,34.9 80.77,24.84 83.36,22.25 89.15,22.25 ROM.23 | RAM0.7 75.44,60.35 76.66,59.13 76.66,46.48 v75.44,45.26 | v65.68,27.43 66.14,27.43 68.28,29.57 69.65,29.57 71.17,31.09 v71.17,34.9 | v20.27,58.22 24.84,58.22 28.8,54.25 30.63,54.25 v32,52.88 | v41.6,46.18 42.06,46.18 42.37,45.87 47.4,45.87 49.84,43.43 51.66,43.43 52.73,42.37 52.73,36.12 50.9,34.29 V2.5
A12  (via drill 0.35)
  Top 0.152: U$4.2 7.62,76.66 6.4,75.44 6.4,74.98 4.57,73.15 4.57,65.68 4.72,65.53 4.72,55.02 8.84,50.9 U$1.2 | 77.72,36.58 74.07,32.92 74.07,32.46 ROM.2 | 77.72,36.58 77.72,41.91 RAM1.8 | 55.32,31.7 58.67,28.35 58.67,9.14 62.18,5.64 83.36,5.64 88.85,11.12 90.37,11.12 91.14,11.89 91.14,35.05 89.61,36.58 77.72,36.58 | 55.32,31.7 50.9,36.12 50.9,36.73 V2.6 | v19.36,44.35 v15.24,48.46 | v27.28,39.32 28.8,37.8 31.85,37.8 34.44,35.2 37.95,35.2 41.6,31.55 41.6,31.39 42.82,30.18 47.85,30.18 49.84,28.19 51.82,28.19 55.32,31.7
  Bottom 0.152: V2.6 50.75,36.88 45.72,36.88 43.28,39.32 V2.14 | RAM0.8 78.03,62.18 78.03,58.98 78.79,58.22 78.79,42.82 77.88,41.91 RAM1.8 | v15.24,48.46 12.95,50.75 8.99,50.75 U$1.2 | v19.36,44.35 19.36,44.04 22.55,40.84 22.55,40.23 23.47,39.32 v27.28,39.32
A13  (via drill 0.35)
  Top 0.152: v8.53,67.36 8.84,67.06 8.84,62.94 8.23,62.33 7.32,62.33 6.1,61.11 6.1,54.1 7.77,52.43 9.3,52.43 10.52,51.21 10.52,50.44 8.99,48.92 8.99,48.31 U$1.3 | v10.67,72.24 10.67,74.37 10.21,74.83 U$4.3 | 41.6,61.42 42.06,61.87 43.59,61.87 44.81,63.09 44.81,63.86 43.28,65.38 43.28,65.99 V4.1 | v41.6,60.05 41.6,61.42 | v41,42.82 42.22,42.82 43.13,41.91 V2.13 48.31,41.91 50.75,39.47 V2.7 50.9,39.32 51.36,38.86 55.63,38.86 57.3,40.54 v57.3,42.37 | v79.4,46.48 78.33,46.48 78.18,46.63 v61.57,46.63 | v26.06,72.69 26.06,70.41 v27.58,68.89 | v29.87,68.89 29.87,68.43 36.42,61.87 41.15,61.87 41.6,61.42
  Bottom 0.152: v8.53,67.36 8.53,67.82 10.67,69.95 10.67,72.08 | 80.47,46.48 80.47,55.17 81.38,56.08 81.38,61.42 80.62,62.18 RAM0.9 | 80.47,46.48 80.47,41.91 RAM1.9 | v41.6,60.05 41.6,47.85 40.69,46.94 40.69,43.13 v41,42.82 | v79.4,46.48 80.47,46.48 | v57.3,42.37 v61.57,46.63 | 10.67,72.08 25.45,72.08 v26.06,72.69 | v29.87,68.89 v27.58,68.89 | 10.67,72.08 v10.67,72.24
A14  (via drill 0.35)
  Top 0.152: v11.58,58.83 11.58,48.31 8.99,45.72 U$1.4 | v12.8,69.19 9.14,72.85 9.14,74.22 8.99,74.37 8.99,76.35 10.06,77.42 U$4.4 | RAM1.10 82.45,41.91 78.03,46.33 62.18,46.33 v60.96,45.11 | v56.69,40.84 55.47,39.62 55.47,39.47 55.17,39.17 53.65,39.17 50.9,41.91 V2.8 | v28.35,69.49 v27.13,70.71 | v34.9,71.63 39.47,71.63 42.06,69.04 42.06,66.9 41.6,66.45 41.6,65.08 V4.2
  Bottom 0.152: v11.58,58.83 11.58,60.05 12.34,60.81 13.26,60.81 14.17,61.72 14.17,64.16 12.8,65.53 v12.8,69.19 13.26,69.19 15.39,71.32 26.52,71.32 v27.13,70.71 | RAM1.10 82.91,41.91 82.91,51.36 81.99,52.27 81.99,61.11 83.06,62.18 RAM0.10 | V2.8 45.72,41.91 V2.12 43.13,44.35 41.6,42.82 41.6,42.22 37.8,38.41 35.81,38.41 35.2,39.01 35.2,39.78 35.81,40.39 37.34,40.39 39.32,42.37 39.32,59.59 43.13,63.4 V4.2 | v56.69,40.84 v60.96,45.11 | v28.35,69.49 30.18,69.49 32.31,71.63 v34.9,71.63
A15  (via drill 0.35)
  Top 0.152: v14.17,59.13 12.34,57.3 12.34,47.24 8.99,43.89 8.99,43.28 U$1.5 | v14.17,69.19 14.17,73.46 U$4.5 | v17.22,58.83 v14.78,61.27 | v30.33,52.12 31.7,53.49 34.75,53.49 36.42,51.82 38.41,51.82 43.13,47.09 V2.11
  Bottom 0.152: v14.17,59.13 14.17,61.27 14.48,61.57 | 14.48,61.57 15.09,62.18 15.09,65.38 15.24,65.53 15.24,68.12 v14.17,69.19 | V5.3 68.58,19.81 70.26,18.14 70.26,17.53 69.49,16.76 67.67,16.76 66.45,17.98 66.45,19.66 64.47,21.64 64.47,34.75 61.42,37.8 58.67,37.8 52.12,44.35 50.9,44.35 V2.9 48.31,46.94 43.28,46.94 V2.11 | v14.78,61.27 14.48,61.57 | v17.22,58.83 18.44,57.61 18.44,54.1 20.57,51.97 22.86,51.97 23.01,52.12 v30.33,52.12
BUSAK  (via drill 0.35)
  Top 0.152: v24.84,46.94 26.06,45.72 26.06,12.65 24.23,10.82 24.23,10.21 U$1.23 | v22.55,49.99 22.55,55.32 v26.36,59.13
  Bottom 0.152: v24.84,46.94 23.47,46.94 22.55,47.85 v22.55,49.99 | v26.36,59.13 26.36,60.05 28.8,62.48 30.18,62.48 34.44,66.75 34.44,70.26 35.51,71.32 35.51,71.93 35.2,72.24 35.2,74.52 35.51,74.83 U$4.23
BUSRQ  (via drill 0.35)
  Top 0.152: U$1.25 24.08,15.24 16.76,7.92 16.76,6.55 14.33,4.12 7.92,4.12 2.59,9.45 2.59,51.97 R4.P$2 | v35.81,72.54 34.14,72.54 v30.79,69.19 | v22.86,61.72 22.86,56.54 19.96,53.65 19.96,43.13 v19.66,42.82
  Bottom 0.152: v35.81,72.54 38.1,74.83 U$4.25 | v30.79,69.19 30.79,68.89 28.96,67.06 28.19,67.06 v22.86,61.72 | v19.66,42.82 19.66,39.62 22.25,37.03 22.25,17.07 24.08,15.24 U$1.25
CLOCK  (via drill 0.35)
  Top 0.152: v13.11,70.1 13.11,72.85 11.43,74.52 11.43,76.2 U$4.6 | v59.28,10.36 v61.57,12.65 | v15.39,10.82 14.78,10.21 14.17,10.21 10.06,14.33 7.77,14.33 6.55,15.54 6.55,27.58 8.53,29.57 9.91,29.57 10.52,30.18 10.52,39.01 U$1.6
  Bottom 0.152: v13.11,70.1 12.8,70.1 12.19,69.49 12.19,65.68 13.87,64.01 13.87,61.87 13.11,61.11 12.19,61.11 10.97,59.89 10.97,58.52 11.28,58.22 11.43,58.22 16,53.65 16,48.31 8.99,41.3 8.99,40.69 U$1.6 | v61.57,12.65 62.48,13.56 74.98,13.56 81.99,20.57 90.37,20.57 95.71,15.24 96.47,15.24 J2.2 | v59.28,10.36 25.91,10.36 25.15,11.12 15.7,11.12 v15.39,10.82
D0  (via drill 0.35)
  Top 0.152: v85.34,54.41 85.34,41.91 RAM1.11 | v84.58,60.35 84.58,61.27 85.5,62.18 RAM0.11 | V3.2 36.88,6.4 36.88,11.43 39.32,13.87 V3.18 | v11.12,12.34 11.12,9.75 v13.87,7.01 | v65.68,15.09 66.29,14.48 66.29,13.72 69.19,10.82 69.34,10.82 70.56,9.6 73.91,9.6 ROM.11 | v23.01,73.3 21.64,73.3 19.05,70.71 19.05,69.8 16.76,67.51 16.76,66.9 13.26,63.4 11.73,63.4 7.92,59.59 7.01,59.59 6.4,58.98 6.4,57.76 10.82,53.34 10.82,48.16 9.3,46.63 7.77,46.63 7.01,45.87 7.01,29.26 v7.16,29.11 | v7.16,24.08 7.16,22.1 8.84,20.42 U$1.14 | v82.3,19.66 v82.3,24.69
  Bottom 0.152: v85.34,54.41 85.34,55.32 84.58,56.08 v84.58,60.35 | v11.12,12.34 11.12,17.53 8.99,19.66 8.99,20.27 U$1.14 | v13.87,7.01 14.94,7.01 17.83,4.12 34.59,4.12 V3.2 | v65.68,15.09 63.09,15.09 62.03,16.15 41.6,16.15 39.47,14.02 V3.18 | U$4.14 22.86,76.66 24.08,75.44 24.08,74.37 v23.01,73.3 | v7.16,24.08 v7.16,29.11 | v82.3,24.69 82.3,29.41 81.99,29.72 81.99,37.95 85.34,41.3 85.34,41.91 RAM1.11 | v82.3,19.66 75.59,12.95 75.59,11.12 74.07,9.6 ROM.11
D1  (via drill 0.35)
  Top 0.152: v81.69,29.11 v81.69,18.14 | RAM0.12 88.09,62.18 88.09,59.74 86.72,58.37 86.72,43.13 87.94,41.91 RAM1.12 | V3.17 41.91,13.87 39.47,11.43 39.47,6.4 V3.3 39.32,6.25 37.8,4.72 33.98,4.72 32.31,6.4 23.32,6.4 22.4,7.32 v22.4,12.04 | v19.36,14.33 19.36,41.6 20.27,42.52 20.27,53.49 25.45,58.67 25.45,74.83 U$4.15 | v69.49,9.75 70.71,8.53 74.98,8.53 75.13,8.69 83.06,8.69 83.67,8.08 83.67,7.16 82.75,6.25 76.66,6.25 76.05,6.86 74.07,6.86 ROM.12 | v65.99,9.75 65.38,9.75 61.27,13.87 v59.28,13.87
  Bottom 0.152: v81.69,18.14 81.69,15.24 74.07,7.62 74.07,7.01 ROM.12 | v81.69,29.11 81.69,38.71 84.58,41.6 84.58,42.98 85.19,43.59 86.26,43.59 87.94,41.91 RAM1.12 | 19.36,11.73 22.1,11.73 v22.4,12.04 | 19.36,11.73 10.82,11.73 10.52,12.04 10.52,15.54 8.99,17.07 8.99,17.68 U$1.15 | 19.36,11.73 v19.36,14.33 | v65.99,9.75 v69.49,9.75 | v59.28,13.87 57.61,15.54 43.43,15.54 41.91,14.02 V3.17
D2  (via drill 0.35)
  Top 0.152: v91.75,17.37 92.35,17.98 92.35,40.23 90.68,41.91 RAM1.13 90.53,41.91 87.02,45.41 87.02,58.22 90.68,61.87 RAM0.13 | v14.94,6.1 12.5,6.1 10.06,8.53 8.53,8.53 7.16,9.91 v7.16,12.04 7.16,13.11 v4.42,15.85 | V3.4 41.91,6.4 44.35,8.84 44.35,13.87 V3.16 v49.53,19.05 | v3.96,71.78 3.96,66.6 v2.44,65.08 | v88.24,33.68 83.06,33.68 75.13,25.76 70.87,25.76 69.19,24.08 66.75,24.08 v61.72,19.05
  Bottom 0.152: v91.75,17.37 90.53,16.15 86.56,16.15 74.98,4.57 74.07,4.57 ROM.13 | v7.16,12.04 7.16,23.16 8.84,24.84 8.84,25.3 U$1.12 | v14.94,6.1 15.39,6.1 17.68,3.81 39.47,3.81 41.91,6.25 V3.4 | v3.96,71.78 5.33,73.15 15.24,73.15 16.46,74.37 16.46,75.29 17.37,76.2 18.29,76.2 19.51,77.42 20.27,77.42 U$4.12 | v2.44,65.08 1.37,64.01 1.37,18.9 v4.42,15.85 | v88.24,33.68 90.07,33.68 90.83,34.44 90.83,35.36 90.68,35.51 90.68,41.91 RAM1.13 | v49.53,19.05 v61.72,19.05
D3  (via drill 0.35)
  Top 0.152: v4.12,65.23 4.12,55.17 5.94,53.34 v5.94,38.56 5.94,15.7 7.92,13.72 9.91,13.72 10.52,13.11 10.52,9.45 v12.34,7.62 | 92.2,63.86 92.2,76.5 93.12,77.42 RAM0.15 | 92.2,63.86 92.2,61.27 92.96,60.5 92.96,57.15 RAM1.15 | V3.5 44.5,6.4 44.5,8.53 46.79,10.82 46.79,13.72 46.94,13.87 V3.15 | v72.08,3.5 74.37,3.5 75.89,1.98 89.15,1.98 ROM.15 89.31,1.98 93.73,6.4 95.56,6.4 97.99,8.84 97.99,59.44 93.57,63.86 92.2,63.86
  Bottom 0.152: v5.94,38.56 8.84,35.66 U$1.8 | v4.12,65.23 4.12,67.82 1.37,70.56 1.37,71.63 3.2,73.46 4.88,73.46 6.4,74.98 6.4,75.44 7.16,76.2 14.02,76.2 15.24,77.42 U$4.8 | v72.08,3.5 71.78,3.5 70.26,1.98 63.55,1.98 57.61,7.92 54.25,7.92 53.03,6.71 53.03,5.33 52.43,4.72 46.02,4.72 44.5,6.25 V3.5 44.35,6.4 42.82,7.92 33.83,7.92 32.61,6.71 23.01,6.71 22.1,7.62 v12.34,7.62
D4  (via drill 0.35)
  Top 0.152: V3.6 47.09,6.4 47.09,11.43 49.53,13.87 V3.14 49.53,14.02 v52.58,17.07 | v6.1,63.09 6.1,64.62 4.88,65.84 4.88,70.56 8.08,73.76 v8.53,73.76 | v84.43,8.53 83.67,8.53 81.08,11.12 69.34,11.12 66.6,13.87 66.6,16.15 v65.68,17.07
  Bottom 0.152: 98.6,11.73 98.6,49.23 90.68,57.15 RAM1.16 90.53,57.15 89.76,57.91 89.76,63.25 90.68,64.16 RAM0.16 | 98.6,11.73 98.6,9.45 97.84,8.69 97.54,8.69 93.42,4.57 89.31,4.57 ROM.16 | 6.86,62.33 7.92,62.33 8.84,61.42 8.84,57.91 7.32,56.39 7.32,40.23 8.84,38.71 8.84,38.1 U$1.7 | v6.1,63.09 6.86,62.33 | v8.53,73.76 14.17,73.76 15.24,74.83 U$4.7 | 6.86,62.33 5.03,60.5 5.03,12.8 6.71,11.12 9.91,11.12 12.19,8.84 24.84,8.84 25.91,7.77 29.57,7.77 30.02,8.23 44.5,8.23 46.33,6.4 46.94,6.4 V3.6 | 98.6,11.73 93.42,11.73 90.22,8.53 v84.43,8.53 | v65.68,17.07 62.18,17.07 61.87,16.76 52.88,16.76 v52.58,17.07
D5  (via drill 0.35)
  Top 0.152: v14.94,58.52 12.65,56.24 12.65,44.96 9.91,42.22 8.53,42.22 7.32,41 7.32,35.2 8.84,33.68 8.84,33.07 U$1.9 | v15.54,68.73 17.22,70.41 17.22,74.37 U$4.9 | 49.53,8.84 49.53,11.43 V3.13 | 49.53,8.84 V3.7 49.53,6.25 v46.18,2.9 | RAM1.17 88.09,57.15 91.44,53.8 91.44,41.6 92.66,40.39 92.66,10.97 89.31,7.62 89.31,7.01 ROM.17 87.63,5.33 73,5.33 72.69,5.03 v71.48,5.03 | v51.97,8.84 49.53,8.84 | v66.45,8.84 v62.64,8.84 | v6.55,7.92 v6.55,12.8
  Bottom 0.152: v14.94,58.52 14.94,60.5 15.39,60.96 15.39,65.23 15.54,65.38 v15.54,68.73 | RAM0.17 87.17,76.5 87.17,61.27 87.94,60.5 87.94,57.15 RAM1.17 | v62.64,8.84 v51.97,8.84 | v66.45,8.84 70.41,8.84 71.48,7.77 v71.48,5.03 | v6.55,12.8 6.55,30.18 8.84,32.46 8.84,32.92 U$1.9 | v6.55,7.92 8.38,6.1 12.5,6.1 15.7,2.9 v46.18,2.9
D6  (via drill 0.35)
  Top 0.152: V3.8 52.12,6.4 52.12,8.08 54.41,10.36 54.41,13.72 54.56,13.87 V3.12 | v13.56,44.96 13.56,50.6 21.95,58.98 v21.95,72.69 | v14.48,10.82 14.48,29.57 v11.73,32.31 | v85.5,9.6 83.06,9.6 79.7,12.95 v68.43,12.95 | v62.79,10.67 60.5,8.38 v60.5,8.23
  Bottom 0.152: RAM0.18 85.5,77.42 84.58,76.5 84.58,61.27 85.34,60.5 85.34,57.15 RAM1.18 85.5,57.15 98.3,44.35 98.3,14.33 97.08,13.11 94.34,13.11 90.83,9.6 89.31,9.6 ROM.18 89.15,9.6 v85.5,9.6 | 10.97,33.07 13.56,35.66 v13.56,44.96 | 10.97,33.07 8.99,31.09 8.99,30.48 U$1.10 | v21.95,72.69 21.95,74.07 21.49,74.52 21.49,78.03 20.88,78.64 18.9,78.64 17.83,77.57 U$4.10 | v14.48,10.82 16.15,9.14 25.15,9.14 26.06,10.06 47.85,10.06 51.51,6.4 51.97,6.4 V3.8 53.95,8.23 v60.5,8.23 | 10.97,33.07 v11.73,32.31 | v68.43,12.95 65.08,12.95 v62.79,10.67
D7  (via drill 0.35)
  Top 0.152: V3.9 54.71,6.4 54.71,11.43 57.15,13.87 V3.11 | v23.47,19.05 v20.88,21.64 | v16.15,67.21 16.15,67.36 18.75,69.95 18.75,70.87 21.49,73.61 21.64,73.61 22.86,74.83 U$4.13 | v15.39,57.61 15.39,54.25 12.95,51.82 12.95,43.89 10.82,41.76 10.82,24.69 8.99,22.86 U$1.13 | v90.07,28.5 90.83,27.74 90.83,13.72 89.31,12.19 ROM.19
  Bottom 0.152: 83.06,57.15 83.06,60.2 83.97,61.11 83.97,76.5 83.06,77.42 RAM0.19 | V3.9 59.28,1.68 70.41,1.68 71.63,2.9 74.52,2.9 75.59,3.96 75.59,4.72 82.91,12.04 89.15,12.04 ROM.19 | U$1.13 19.66,22.86 v20.88,21.64 | v23.47,19.05 31.24,19.05 35.81,14.48 35.81,12.95 36.42,12.34 55.63,12.34 57.15,13.87 V3.11 | v16.15,67.21 16.15,64.01 15.7,63.55 15.7,57.91 v15.39,57.61 | 83.06,57.15 83.06,51.66 89,45.72 89,36.58 87.63,35.2 87.63,29.57 88.7,28.5 v90.07,28.5 | 83.06,57.15 RAM1.19
GND  (via drill 0.35)
  Top 0.152: U$2.3 7.62,66.45 5.18,68.89 5.18,70.41 5.79,71.02 6.86,71.02 7.92,69.95 8.84,69.95 J1.2 | V6.7 29.11,50.9 29.11,51.51 27.58,53.03 27.58,54.25 V6.5 29.26,55.93 | 29.26,55.93 29.26,58.37 V6.4 | v17.07,57.91 12.8,62.18 C11.2 | V4.12 50.75,60.96 50.75,63.4 V4.13 | v55.93,68.58 C3.2 | C5.2 U$4.29 | C6.2 35.51,69.8 35.51,66.75 35.2,66.45 35.2,65.08 36.73,63.55 V6.13 | 49.23,51.82 49.23,50.44 50.75,48.92 50.75,47.09 V2.10 | 50.75,53.34 49.23,51.82 | 50.75,53.34 50.75,55.78 V4.10 | 50.75,53.34 V4.9 | V6.10 36.88,55.78 36.88,53.34 V6.9 | 44.81,53.03 43.28,51.51 43.28,50.9 V4.7 | 44.81,53.03 44.81,54.25 V4.5 43.13,55.93 36.88,55.93 V6.10 | C2.2 65.99,48.31 59.13,48.31 56.39,51.05 56.39,52.73 51.66,57.45 44.2,57.45 43.28,58.37 V4.4 | 49.23,51.82 46.02,51.82 44.81,53.03 | 29.26,55.93 36.73,55.93 V6.10 | 50.75,22.86 50.75,24.08 V2.1 | 48.92,21.03 48.31,20.42 C9.2 | 48.92,21.03 50.75,22.86 | V5.15 V5.14 V5.13 64.62,26.52 v65.38,26.52 | 50.75,22.86 C4.2 55.93,22.86 55.93,21.79 58.06,19.66 58.06,6.25 | 34.9,21.03 34.29,20.42 C8.2 | 34.9,21.03 36.73,22.86 36.73,24.08 V1.1 36.88,24.23 39.32,26.67 V2.19 43.28,26.67 48.92,21.03 | V3.19 30.63,7.77 28.8,7.77 28.04,8.53 28.04,9.3 29.11,10.36 29.11,11.43 C10.2 | 34.9,21.03 29.26,26.67 V1.19 | 93.12,41.91 93.12,55.17 94.03,56.08 94.03,61.42 RAM0.14 | 58.06,6.25 61.11,6.25 62.33,5.03 68.58,5.03 69.8,3.81 ROMSEL1.3 69.95,3.81 71.78,1.98 73.91,1.98 ROM.14 | 58.06,6.25 57.15,6.25 V3.10 | 93.12,41.91 93.12,13.56 J2.1 | 93.12,41.91 RAM1.14
  Bottom 0.152: C11.2 12.65,62.33 8.69,62.33 7.62,63.4 U$2.3 | 21.64,50.29 23.16,51.82 28.19,51.82 V6.7 29.26,50.75 29.26,49.38 32,46.63 32,29.41 29.26,26.67 V1.19 29.11,26.67 27.89,25.45 24.23,25.45 U$1.29 | 21.64,50.29 17.83,46.48 17.83,44.5 C1.2 | v17.07,57.91 17.07,54.86 21.64,50.29 | 53.19,65.84 50.9,63.55 V4.13 | 53.19,65.84 v55.93,68.58 | 53.19,65.84 49.23,69.8 48.31,69.8 C5.2 | 36.88,60.96 36.88,63.4 V6.13 | V1.10 36.88,47.09 36.88,48.92 38.41,50.44 38.41,51.82 36.88,53.34 V6.9 | V4.4 43.13,58.37 43.13,55.93 V4.5 | 36.88,60.96 36.88,60.35 38.41,58.83 38.41,57.45 V6.10 | 36.88,60.96 V6.12 | V4.10 49.23,57.45 49.23,58.83 50.75,60.35 50.75,60.96 V4.12 | v65.38,26.52 65.08,26.82 65.08,30.94 67.06,32.92 68.58,32.92 V5.8 | V5.13 C4.2 | V3.19 36.73,14.02 36.73,17.83 34.29,20.27 C8.2 | ROM.14 74.07,1.98 79.7,7.62 C7.2 81.08,6.55 83.06,6.55 84.43,7.92 90.07,7.92 92.2,10.06 96.47,10.06 J2.1 | ROMSEL0.1 69.95,7.62 69.95,3.81 ROMSEL1.3
HALT  (via drill 0.35)
  Top 0.152: U$1.18 12.65,6.4 14.17,6.4 15.85,8.08 15.85,10.36 16.31,10.82 16.31,46.48 14.63,48.16 14.63,50.29 v19.36,55.02 | v24.84,72.69 v24.84,68.89
  Bottom 0.152: v19.36,55.02 19.36,58.98 19.05,59.28 19.05,60.5 25.3,66.75 25.3,68.43 v24.84,68.89 | v24.84,72.69 26.67,74.52 26.67,76.2 U$4.18
INT
  Top 0.152: U$1.16 8.99,15.24 8.99,15.85 11.12,17.98 11.12,41.6 14.17,44.65 14.17,50.75 22.25,58.83 22.25,65.38 24.08,67.21 R2.P$2 24.23,67.36 24.23,75.44 25.3,76.5 25.3,77.42 U$4.16
IORQ
  Top 0.152: U$1.20 8.99,5.18 14.94,5.18 16.46,6.71 16.46,10.06 20.27,13.87 20.27,41.6 22.55,43.89 22.55,48.62 23.77,49.84 25.91,49.84 26.98,50.9 26.98,67.21 28.96,69.19 28.96,74.22 29.26,74.52 29.26,76.2 30.48,77.42 U$4.20
M1
  Bottom 0.152: U$1.27 24.23,20.42 24.23,21.03 27.58,24.38 27.58,24.54 28.8,25.76 30.33,25.76 33.53,28.96 33.53,64.92 40.54,71.93 40.54,74.83 U$4.27
MREQ  (via drill 0.35)
  Top 0.152: v63.25,3.5 v56.54,3.5 | v65.38,12.34 65.38,13.56 65.08,13.87 65.08,17.37 65.38,17.68 66.14,17.68 V5.1 | v41.15,16.76 42.82,15.09 42.82,9.3 41,7.47 v41,3.5
  Bottom 0.152: U$1.19 11.43,7.62 15.54,3.5 v41,3.5 v56.54,3.5 | v63.25,3.5 64.16,2.59 65.23,2.59 65.99,3.35 65.99,8.38 65.38,8.99 v65.38,12.34 | U$4.19 30.48,75.74 31.85,77.11 31.85,78.03 32.46,78.64 41.15,78.64 41.91,77.88 41.91,70.1 38.71,66.9 38.71,44.35 37.19,42.82 35.81,42.82 34.9,41.91 34.9,23.01 v41.15,16.76
N$1
  Top 0.152: ROM.26 89.15,29.72 80.92,29.72 74.98,23.77 67.51,23.77 64.77,21.03 64.77,11.89 67.21,9.45 67.21,7.62 ROMSEL0.2
N$2
  Bottom 0.152: V4.3 43.74,60.96 50.44,54.25 55.63,54.25 63.86,46.02 63.86,35.81 64.77,34.9 64.77,21.79 68.58,17.98 V5.2
N$3  (via drill 0.35)
  Top 0.152: V5.6 68.58,28.5 66.9,30.18 66.9,31.7 65.99,32.61 65.99,33.83 65.38,34.44 v63.86,34.44 | v54.86,39.78 51.21,43.43 v35.36,43.43 | V6.1 v34.44,60.81
  Bottom 0.152: v63.86,34.44 60.2,34.44 v54.86,39.78 | v35.36,43.43 35.36,43.89 34.44,44.81 v34.44,60.81
N$4
  Top 0.152: V5.7 66.9,32.16 66.9,33.38 64.16,36.12 64.16,42.37 62.94,43.59 61.57,43.59 56.08,49.07 56.08,52.58 51.82,56.84 42.82,56.84 40.23,59.44 28.8,59.44 27.58,60.66 27.58,61.27 29.11,62.79 29.11,63.4 V6.2
N$5  (via drill 0.35)
  Top 0.152: v71.17,26.98 71.78,26.98 73.76,28.96 75.13,28.96 81.08,34.9 v81.08,35.97
  Bottom 0.152: v71.17,26.98 69.65,25.45 68.58,25.45 V5.5 | v81.08,35.97 81.08,40.54 81.69,41.15 81.69,76.35 80.62,77.42 RAM0.20
N$6
  Top 0.152: V5.4 70.1,21.34 74.83,21.34 81.53,14.63 89.15,14.63 ROM.20
N$7
  Top 0.152: RAM1.20 79.86,57.15 77.57,59.44 40.69,59.44 40.39,59.74 30.48,59.74 29.26,60.96 V6.3
N$9  (via drill 0.35)
  Top 0.152: v65.68,14.17 65.68,12.95 68.58,10.06 v68.58,6.55
  Bottom 0.152: v65.68,14.17 66.29,14.78 66.29,14.94 67.51,16.15 69.8,16.15 72.08,18.44 72.08,33.07 73.91,34.9 ROM.1 | v68.58,6.55 68.58,5.03 67.36,3.81 ROMSEL1.2
NMI
  Top 0.152: U$1.17 8.84,12.8 8.38,12.8 3.81,17.37 3.81,62.18 2.59,63.4 R3.P$2
  Bottom 0.152: U$4.17 27.89,74.83 27.89,73.61 25.91,71.63 13.72,71.63 5.64,63.55 2.59,63.55 R3.P$2
RD  (via drill 0.35)
  Top 0.152: v91.75,18.29 91.75,36.12 86.41,41.45 86.41,54.25 84.28,56.39 | 84.28,56.39 83.97,56.69 83.97,68.89 75.44,77.42 RAM0.22 | v56.84,60.35 56.84,62.03 51.82,67.06 49.53,67.06 47.09,69.49 47.09,69.95 46.02,71.02 45.41,71.02 41.91,74.52 41.91,75.44 41.15,76.2 35.05,76.2 33.83,74.98 33.07,74.98 U$4.21 | v63.55,55.47 69.04,55.47 73.61,50.9 78.79,50.9 84.28,56.39 | v15.85,7.01 15.85,7.62 16.15,7.92 16.15,10.21 19.96,14.02 19.96,41.76 20.88,42.67 v20.88,52.58
  Bottom 0.152: V3.1 34.29,6.25 33.22,5.18 24.23,5.18 U$1.21 24.08,5.18 17.68,5.18 v15.85,7.01 | RAM1.22 75.29,57.15 75.29,59.59 74.22,60.66 74.22,76.2 75.44,77.42 RAM0.22 | v91.75,18.29 90.37,19.66 89.31,19.66 ROM.22 | v56.84,60.35 56.84,58.37 59.74,55.47 v63.55,55.47 | v20.88,52.58 18.75,54.71 18.75,63.7 24.54,69.49 27.43,69.49 32.92,74.98 U$4.21
RESET
  Top 0.152: U$2.2 11.73,65.08 | 11.73,65.08 12.65,65.99 13.87,65.99 R5.P$1 14.02,65.99 18.44,70.41 18.44,71.02 21.49,74.07 21.49,75.29 22.4,76.2 23.32,76.2 24.08,76.96 24.08,77.88 24.84,78.64 36.12,78.64 37.19,77.57 38.1,77.57 U$4.26 | 11.73,65.08 7.01,69.8 6.4,69.8 J1.1
  Bottom 0.152: U$2.2 5.33,58.67 5.33,12.95 6.86,11.43 24.84,11.43 25.76,12.34 25.76,15.54 24.23,17.07 24.23,17.68 U$1.26
RFSH  (via drill 0.35)
  Top 0.152: v32.61,34.59 v31.39,33.38
  Bottom 0.152: v31.39,33.38 31.39,32 30.18,30.79 28.8,30.79 27.58,29.57 23.77,29.57 22.55,28.35 22.55,24.99 24.08,23.47 24.08,22.86 U$1.28 | v32.61,34.59 32.61,64.47 39.47,71.32 39.47,76.35 40.54,77.42 U$4.28
VCC  (via drill 0.35)
  Top 0.152: 43.28,22.86 43.28,24.08 V2.20 | 43.28,22.86 45.72,20.42 C9.1 | V1.20 29.26,24.08 29.26,22.86 31.7,20.42 C8.1 31.85,20.27 31.85,16.46 34.29,14.02 V3.20 34.29,13.87 | 34.29,13.87 29.26,8.84 C10.1 | 34.29,13.87 43.28,22.86 | ROM.27 89.31,32.46 89.31,34.9 ROM.28 | C7.1 81.53,7.62 80.47,6.55 76.81,6.55 75.44,7.92 71.93,7.92 69.95,5.94 66.45,5.94 ROMSEL0.3 | RAM0.28 60.2,76.96 65.38,71.78 | C3.1 65.38,71.78 | V4.14 50.75,66.14 49.38,66.14 45.72,69.8 C5.1 | RAM1.28 60.2,57.15 60.2,56.69 65.99,50.9 C2.1 | 65.38,71.78 63.7,70.1 57,70.1 v56.39,69.49 | R3.P$1 1.37,69.95 1.37,62.94 2.44,61.87 2.44,59.74 R4.P$1 | 36.73,68.73 36.73,70.26 35.97,71.02 34.14,71.02 33.07,69.95 C6.1 | 36.73,68.73 36.73,66.14 V6.14 | U$2.1 7.62,58.52 8.69,59.59 12.65,59.59 C11.1 12.8,59.74 14.63,59.74 15.54,58.83 15.54,58.52 16.76,57.3 17.37,57.3 19.66,59.59 20.27,59.59 R1.P$1 | v17.83,70.71 17.83,70.87 20.27,73.3 20.27,74.83 U$4.11 | 36.73,68.73 v41.45,68.73
  Bottom 0.152: C4.1 55.78,20.42 49.68,20.42 48.62,21.49 46.79,21.49 45.72,20.42 C9.1 | ROM.27 89.31,32.31 89.31,31.85 96.47,24.69 96.47,20.27 J2.3 96.62,20.12 96.62,17.22 97.99,15.85 97.99,14.48 96.93,13.41 92.66,13.41 89.76,10.52 85.5,10.52 82.6,7.62 C7.1 | 60.96,12.04 60.96,11.43 ROMSEL0.3 ROMSEL1.1 | 60.96,12.04 V5.16 | 60.96,12.04 36.12,12.04 34.29,13.87 V3.20 | 59.74,65.08 57.15,62.48 49.84,62.48 49.23,63.09 49.23,63.86 50.75,65.38 50.75,65.99 V4.14 | 59.74,65.08 60.35,65.08 61.42,64.01 61.42,58.37 60.2,57.15 RAM1.28 | v56.39,69.49 56.39,69.04 59.74,65.68 59.74,65.08 | 5.94,67.67 2.59,71.02 R3.P$1 | 5.94,67.67 6.25,67.36 6.25,66.14 R5.P$2 | 5.94,67.67 7.62,69.34 7.62,70.26 10.21,72.85 17.37,72.85 19.36,74.83 20.27,74.83 U$4.11 | U$1.11 8.99,28.04 8.99,28.65 15.24,34.9 C1.1 15.24,47.09 16.31,48.16 16.31,55.78 15.39,56.69 | R1.P$1 20.42,59.74 24.08,59.74 R2.P$1 24.23,59.74 24.23,60.5 28.19,64.47 29.57,64.47 32.92,67.82 32.92,69.8 C6.1 | 15.39,56.69 12.8,59.28 12.8,59.59 C11.1 | v17.83,70.71 17.83,67.67 17.98,67.51 17.98,65.38 16,63.4 16,57.3 15.39,56.69 | v41.45,68.73 42.52,69.8 45.72,69.8 C5.1 | V1.20 29.26,24.23 33.83,28.8 33.83,63.09 36.73,65.99 V6.14
WAIT
  Bottom 0.152: U$1.24 24.08,12.8 24.08,13.26 21.49,15.85 21.49,37.34 16.61,42.22 16.61,57.45 16.46,57.61 16.46,63.4 20.27,67.21 R1.P$2 20.42,67.36 22.86,69.8 27.13,69.8 31.7,74.37 31.7,75.29 32.61,76.2 33.53,76.2 34.75,77.42 35.51,77.42 U$4.24
WR  (via drill 0.35)
  Top 0.152: v62.03,64.77 64.31,64.77 67.06,67.51 | 67.06,67.51 68.89,69.34 68.89,71.32 RAM0.27 | 31.7,74.37 31.85,74.52 31.85,76.35 32.92,77.42 U$4.22 | 31.7,74.37 29.26,71.93 29.26,69.04 27.28,67.06 27.28,50.75 26.36,49.84 26.36,10.36 24.23,8.23 24.23,7.62 U$1.22 | 67.06,67.51 71.48,63.09 71.48,60.05 71.17,59.74 56.54,59.74 51.21,65.08 46.48,65.08 37.8,73.76 32.31,73.76 31.7,74.37
  Bottom 0.152: v62.03,64.77 61.72,64.47 61.72,61.27 62.48,60.5 62.48,57.15 RAM1.27

### Text on the board
tPlace: RESET | WNTRMUTE | ALL R=10K / ALL C=0.1µF | VCC | CLK | 1 | 0 | GND | ROMSEL / BANK0: 00 | KZ80/MAINBOARD | PWR/CLK | -/CLK/+
bPlace: REV3/20191004 | K_ISOM/OAK_CA